# Altium schematic sheet RFE_Cellularv2_1.SchDoc
size A4
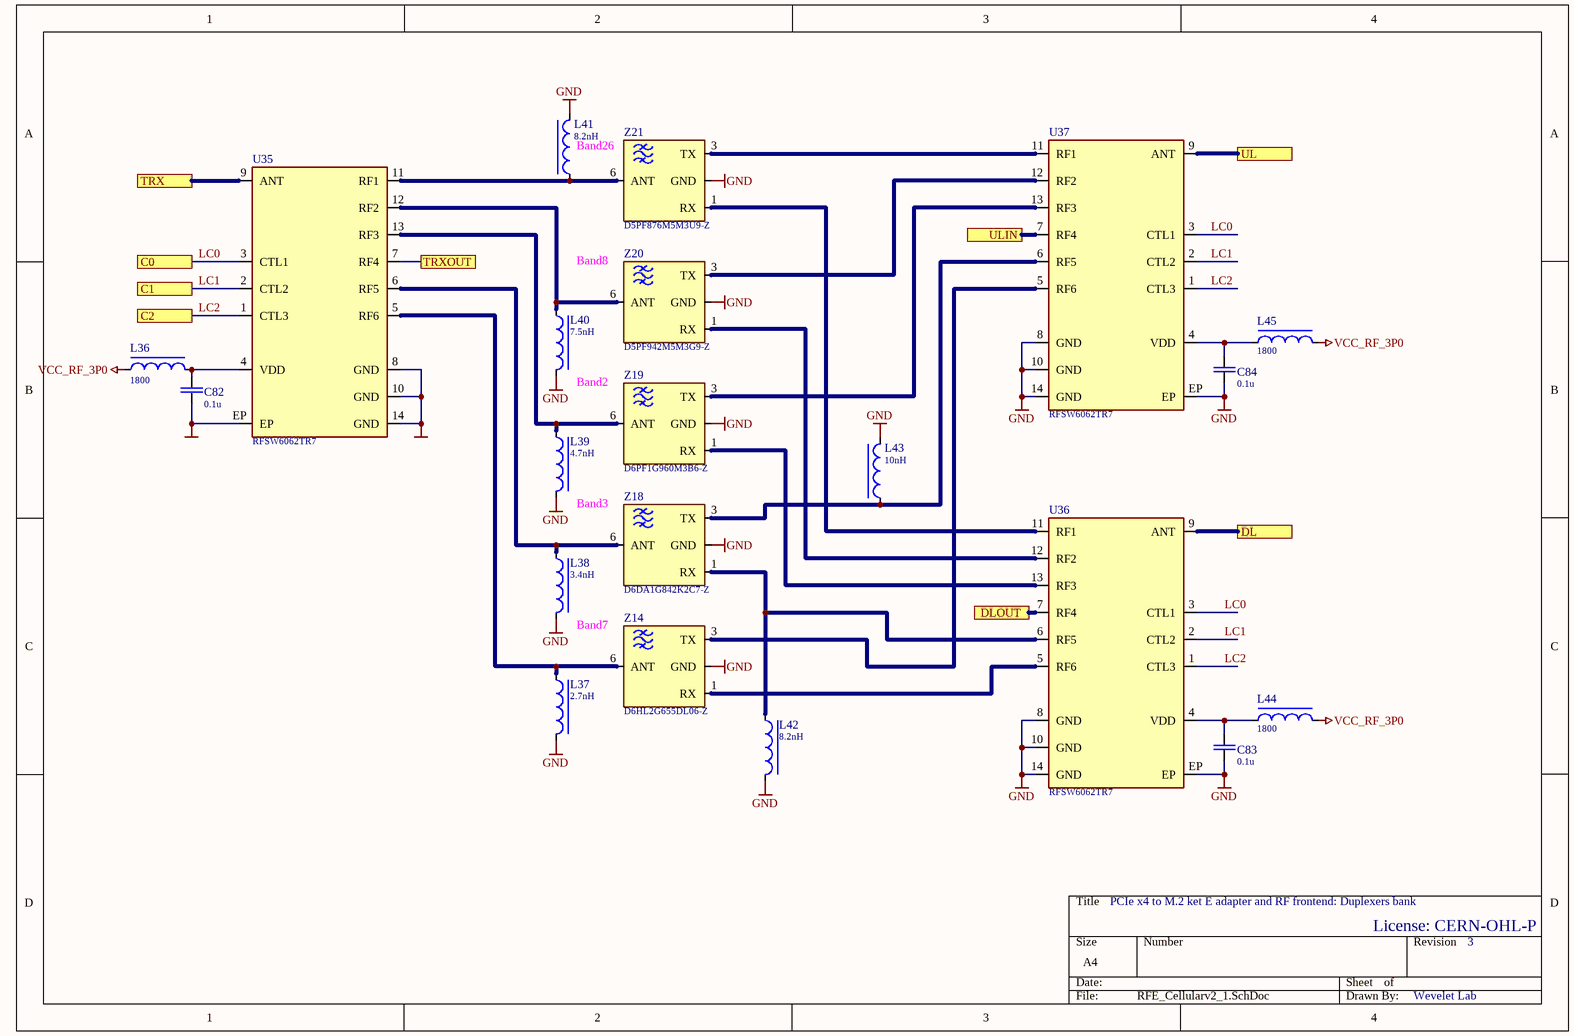
[diagram p0: RFE_Cellularv2_1.SchDoc]

## Parts
C82  value 0.1u  [CAPC100X50X55L25N]  (hidden comment: GRM155R71E104KE14D)
C83  value 0.1u  [CAPC100X50X55L25N]  (hidden comment: GRM155R71E104KE14D)
C84  value 0.1u  [CAPC100X50X55L25N]  (hidden comment: GRM155R71E104KE14D)
L36  value 1800  [INDC100X60X60L30N]  (hidden comment: BLM15HD182SN1D)
L37  value 2.7nH  [INDC60X30X35L15N]  (hidden comment: MLG0603P2N7CT000)
L38  value 3.4nH  [INDC60X30X35L15N]  (hidden comment: MLG0603P3N4BT000)
L39  value 4.7nH  [INDC60X30X35L15N]  (hidden comment: MLG0603P4N7HT000)
L40  value 7.5nH  [INDC60X30X35L15N]  (hidden comment: MLG0603P7N5HT000)
L41  value 8.2nH  [INDC60X30X35L15N]  (hidden comment: MLG0603P8N2HT000)
L42  value 8.2nH  [INDC60X30X35L15N]  (hidden comment: MLG0603P8N2HT000)
L43  value 10nH  [INDC60X30X35L15N]  (hidden comment: MLG0603P10NHT000)
L44  value 1800  [INDC100X60X60L30N]  (hidden comment: BLM15HD182SN1D)
L45  value 1800  [INDC100X60X60L30N]  (hidden comment: BLM15HD182SN1D)
U35  RFSW6062TR7  [QFN15P40_200X200X60L21X18T100N]
U36  RFSW6062TR7  [QFN15P40_200X200X60L21X18T100N]
U37  RFSW6062TR7  [QFN15P40_200X200X60L21X18T100N]
Z14  D6HL2G655DL06-Z  [TAIYO_YUDEN_SMD-9]
Z18  D6DA1G842K2C7-Z  [TAIYO_YUDEN_SMD-8]
Z19  D6PF1G960M3B6-Z  [TAIYO_YUDEN_SMD-9]
Z20  D5PF942M5M3G9-Z  [TAIYO_YUDEN_SMD-9]
Z21  D5PF876M5M3U9-Z  [TAIYO_YUDEN_SMD-9]

## Ports
C0, C1, C2, DL, DLOUT, TRX, TRXOUT, UL, ULIN

## Nets
GND: C82.2 C83.2 C84.2 L37.2 L38.2 L39.2 L40.2 L41.2 L42.2 L43.2 U35.8(GND) U35.10(GND) U35.14(GND) U35.EP U36.8(GND) U36.10(GND) U36.14(GND) U36.EP U37.8(GND) U37.10(GND) U37.14(GND) U37.EP Z14.GND Z18.GND Z19.GND Z20.GND Z21.GND
VCC_RF_3P0: L36.2 L44.2 L45.2
DL: U36.9(ANT) ; port DL
DLOUT: U36.7(RF4) ; port DLOUT
LC0: U35.3(CTL1) U36.3(CTL1) U37.3(CTL1) ; port C0
LC1: U35.2(CTL2) U36.2(CTL2) U37.2(CTL2) ; port C1
LC2: U35.1(CTL3) U36.1(CTL3) U37.1(CTL3) ; port C2
TRX: U35.9(ANT) ; port TRX
TRXOUT: U35.7(RF4) ; port TRXOUT
UL: U37.9(ANT) ; port UL
ULIN: U37.7(RF4) ; port ULIN
NetC82_1: C82.1 L36.1 U35.4(VDD)
NetC83_1: C83.1 L44.1 U36.4(VDD)
NetC84_1: C84.1 L45.1 U37.4(VDD)
NetL37_1: L37.1 U35.5(RF6) Z14.6(ANT)
NetL38_1: L38.1 U35.6(RF5) Z18.6(ANT)
NetL39_1: L39.1 U35.13(RF3) Z19.6(ANT)
NetL40_1: L40.1 U35.12(RF2) Z20.6(ANT)
NetL41_1: L41.1 U35.11(RF1) Z21.6(ANT)
NetL42_1: L42.1 U36.6(RF5) Z18.1(RX)
NetL43_1: L43.1 U37.6(RF5) Z18.3(TX)
NetU36_5: U36.5(RF6) Z14.1(RX)
NetU36_11: U36.11(RF1) Z21.1(RX)
NetU36_12: U36.12(RF2) Z20.1(RX)
NetU36_13: U36.13(RF3) Z19.1(RX)
NetU37_5: U37.5(RF6) Z14.3(TX)
NetU37_11: U37.11(RF1) Z21.3(TX)
NetU37_12: U37.12(RF2) Z20.3(TX)
NetU37_13: U37.13(RF3) Z19.3(TX)

## Notes on the sheet
- Band26
- (near Z20) Band8
- Band2
- Band3
- Band7
- PCIe x4 to M.2 ket E adapter and RF frontend: Duplexers bank
- License: CERN-OHL-P
- 3
- Wevelet Lab

## Library data of the parts
C82-C84 = GRM155R71E104KE14D: Capacitor, 0.1u, 25V, 10%, X7R, 0402; Manufacturer: Murata Electronics
L36 L44 L45 = BLM15HD182SN1D: Ferrite bead, 1800Ohm@100MHz, 0,2A, 2.2Ohm, -55/+125, SMD0402; Manufacturer: Murata Electronics; Name: BLM15HD182SN1D
L37 = MLG0603P2N7CT000: Inductor, 2.7n, 0.5A, 200mOhm, -55/+125, SMD0201; Manufacturer: TDK; Name: MLG0603P2N7CT000
L38 = MLG0603P3N4BT000: Inductor, 3.4n, -55/+125, SMD0201; Manufacturer: TDK; Name: MLG0603P3N4BT000
L39 = MLG0603P4N7HT000: Inductor, 4.7n, -55/+125, SMD0201; Manufacturer: TDK; Name: MLG0603P4N7HT000
L40 = MLG0603P7N5HT000: Inductor, 7.5n, -55/+125, SMD0201; Manufacturer: TDK; Name: MLG0603P7N5HT000
L41 L42 = MLG0603P8N2HT000: Inductor, 8.2n, -55/+125, SMD0201; Manufacturer: TDK; Name: MLG0603P8N2HT000
L43 = MLG0603P10NHT000: Inductor, 10n, -55/+125, SMD0201; Manufacturer: TDK; Name: MLG0603P10NHT000
U35-U37 = RFSW6062: IC, Switch, SP6T, 5-6000MHz, -40/+85, / 14-QFN; Manufacturer: Qorvo; Value: RFSW6062TR7
Z14 = D6HL2G655DL06: RF DUPLEXER, Band 7, -20/+85, SMD9; Manufacturer: TAIYO YUDEN; Value: D6HL2G655DL06-Z
Z18 = D6DA1G842K2C7: RF DUPLEXER, Band 3, -20/+85, SMD8; Manufacturer: TAIYO YUDEN; Value: D6DA1G842K2C7-Z
Z19 = D6PF1G960M3B6: RF DUPLEXER, Band 2, -20/+85, SMD9; Manufacturer: TAIYO YUDEN; Value: D6PF1G960M3B6-Z
Z20 = D5PF942M5M3G9: RF DUPLEXER, Band 8, -20/+85, SMD9; Manufacturer: TAIYO YUDEN; Value: D5PF942M5M3G9-Z
Z21 = D5PF876M5M3U9: RF DUPLEXER, Band 26, -20/+85, SMD9; Manufacturer: TAIYO YUDEN; Value: D5PF876M5M3U9-Z